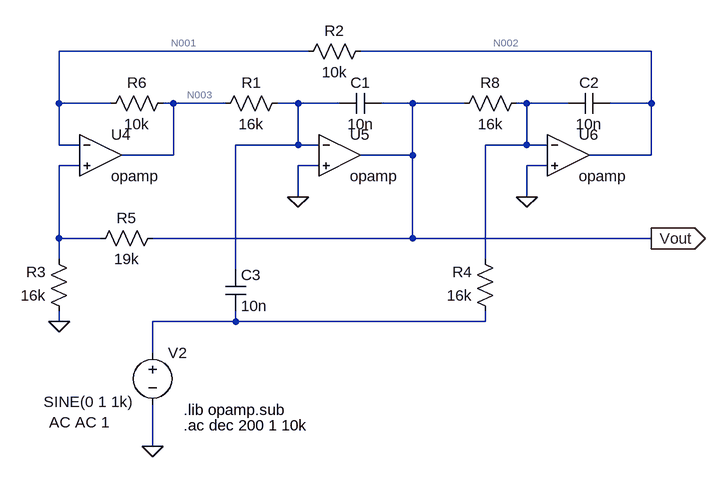
[diagram p0: schematic Input Notch.asc]
Input Notch.asc, the LTspice schematic file:
Version 4
SHEET 1 1688 680
WIRE 368 -64 -16 -64
WIRE 896 -64 448 -64
WIRE -16 16 -16 -64
WIRE 64 16 -16 16
WIRE 160 16 144 16
WIRE 240 16 160 16
WIRE 352 16 320 16
WIRE 416 16 352 16
WIRE 528 16 480 16
WIRE 608 16 528 16
WIRE 704 16 688 16
WIRE 768 16 704 16
WIRE 896 16 896 -64
WIRE 896 16 832 16
WIRE -16 80 -16 16
WIRE 16 80 -16 80
WIRE 352 80 352 16
WIRE 352 80 256 80
WIRE 384 80 352 80
WIRE 704 80 704 16
WIRE 704 80 640 80
WIRE 736 80 704 80
WIRE 160 96 160 16
WIRE 160 96 80 96
WIRE 528 96 528 16
WIRE 528 96 448 96
WIRE 896 96 896 16
WIRE 896 96 800 96
WIRE 16 112 -16 112
WIRE 384 112 352 112
WIRE 736 112 704 112
WIRE 352 160 352 112
WIRE 704 160 704 112
WIRE -16 224 -16 112
WIRE 48 224 -16 224
WIRE 528 224 528 96
WIRE 528 224 128 224
WIRE 896 224 528 224
WIRE -16 256 -16 224
WIRE 640 256 640 80
WIRE 256 272 256 80
WIRE -16 352 -16 336
WIRE 256 352 256 336
WIRE 256 352 128 352
WIRE 640 352 640 336
WIRE 640 352 256 352
WIRE 128 400 128 352
WIRE 128 544 128 480
FLAG 352 160 0
FLAG 704 160 0
FLAG 128 544 0
FLAG -16 352 0
FLAG 896 224 Vout
IOPIN 896 224 Out
SYMBOL res 144 208 R90
WINDOW 0 0 56 VBottom 2
WINDOW 3 32 56 VTop 2
SYMATTR InstName R5
SYMATTR Value 19k
SYMBOL res 160 0 R90
WINDOW 0 0 56 VBottom 2
WINDOW 3 32 56 VTop 2
SYMATTR InstName R6
SYMATTR Value 10k
SYMBOL res 704 0 R90
WINDOW 0 0 56 VBottom 2
WINDOW 3 32 56 VTop 2
SYMATTR InstName R8
SYMATTR Value 16k
SYMBOL res 336 0 R90
WINDOW 0 0 56 VBottom 2
WINDOW 3 32 56 VTop 2
SYMATTR InstName R1
SYMATTR Value 16k
SYMBOL cap 480 0 R90
WINDOW 0 0 32 VBottom 2
WINDOW 3 32 32 VTop 2
SYMATTR InstName C1
SYMATTR Value 10n
SYMBOL cap 832 0 R90
WINDOW 0 0 32 VBottom 2
WINDOW 3 32 32 VTop 2
SYMATTR InstName C2
SYMATTR Value 10n
SYMBOL res 464 -80 R90
WINDOW 0 0 56 VBottom 2
WINDOW 3 32 56 VTop 2
SYMATTR InstName R2
SYMATTR Value 10k
SYMBOL OpAmps\\opamp 48 32 R0
SYMATTR InstName U4
SYMBOL OpAmps\\opamp 416 32 R0
SYMATTR InstName U5
SYMBOL OpAmps\\opamp 768 32 R0
SYMATTR InstName U6
SYMBOL res 0 352 R180
WINDOW 0 36 76 Left 2
WINDOW 3 36 40 Left 2
SYMATTR InstName R3
SYMATTR Value 16k
SYMBOL voltage 128 384 R0
WINDOW 3 -168 92 Left 2
WINDOW 123 -159 123 Left 2
WINDOW 39 0 0 Left 0
SYMATTR Value SINE(0 1 1k)
SYMATTR Value2 AC AC 1
SYMATTR InstName V2
SYMBOL cap 240 272 R0
SYMATTR InstName C3
SYMATTR Value 10n
SYMBOL res 656 352 R180
WINDOW 0 36 76 Left 2
WINDOW 3 36 40 Left 2
SYMATTR InstName R4
SYMATTR Value 16k
TEXT 176 512 Left 2 !.ac dec 200 1 10k
TEXT 176 488 Left 2 !.lib opamp.sub

The netlist it stands for:
* Input Notch.asc
R5 Vout N006 19k
R6 N003 N001 10k
R8 N005 Vout 16k
R1 N004 N003 16k
C1 Vout N004 10n
C2 N002 N005 10n
R2 N002 N001 10k
XU4 N001 N006 N003 opamp Aol=100K GBW=10Meg  ; pins invin noninvin out
XU5 N004 0 Vout opamp Aol=100K GBW=10Meg  ; pins invin noninvin out
XU6 N005 0 N002 opamp Aol=100K GBW=10Meg  ; pins invin noninvin out
R3 0 N006 16k
V2 N007 0 SINE(0 1 1k) AC AC 1
C3 N004 N007 10n
R4 N007 N005 16k
.ac dec 200 1 10k
.lib opamp.sub
.backanno
.end

* Results of the author's LTspice run, read from the files saved beside the schematic
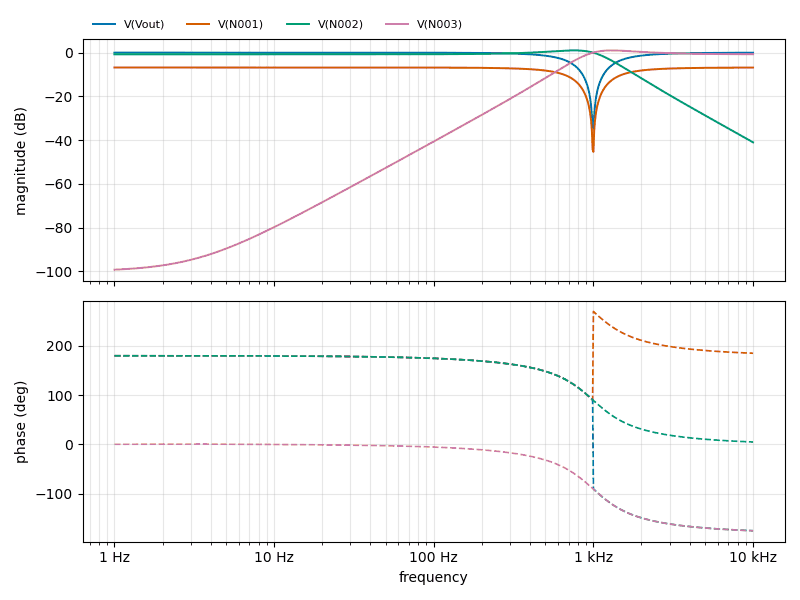
[diagram p1: AC Analysis of Input Notch.asc, plotted from the saved traces]
* AC Analysis, 1 run:
*   V(Vout): -0.00 dB at 1 Hz, -0.03 dB at 10 kHz, peak -0.00 dB at 1 Hz, 3 dB below the peak at 639 Hz
*   V(N001): -6.80 dB at 1 Hz, -6.83 dB at 10 kHz, peak -6.80 dB at 1 Hz, 3 dB below the peak at 639 Hz
*   V(N002): -0.78 dB at 1 Hz, -41.01 dB at 10 kHz, peak 1.02 dB at 758.6 Hz, 3 dB below the peak at 1.175 kHz
*   V(N003): -99.23 dB at 1 Hz, -0.73 dB at 10 kHz, peak 1.02 dB at 1.303 kHz, 3 dB below the peak at 842.1 Hz